# EAGLE design working (EAGLE 9.5.1)
COMPANY: ADAFRUIT INDUSTRIES; DRAWN: KTOWN; REV: A
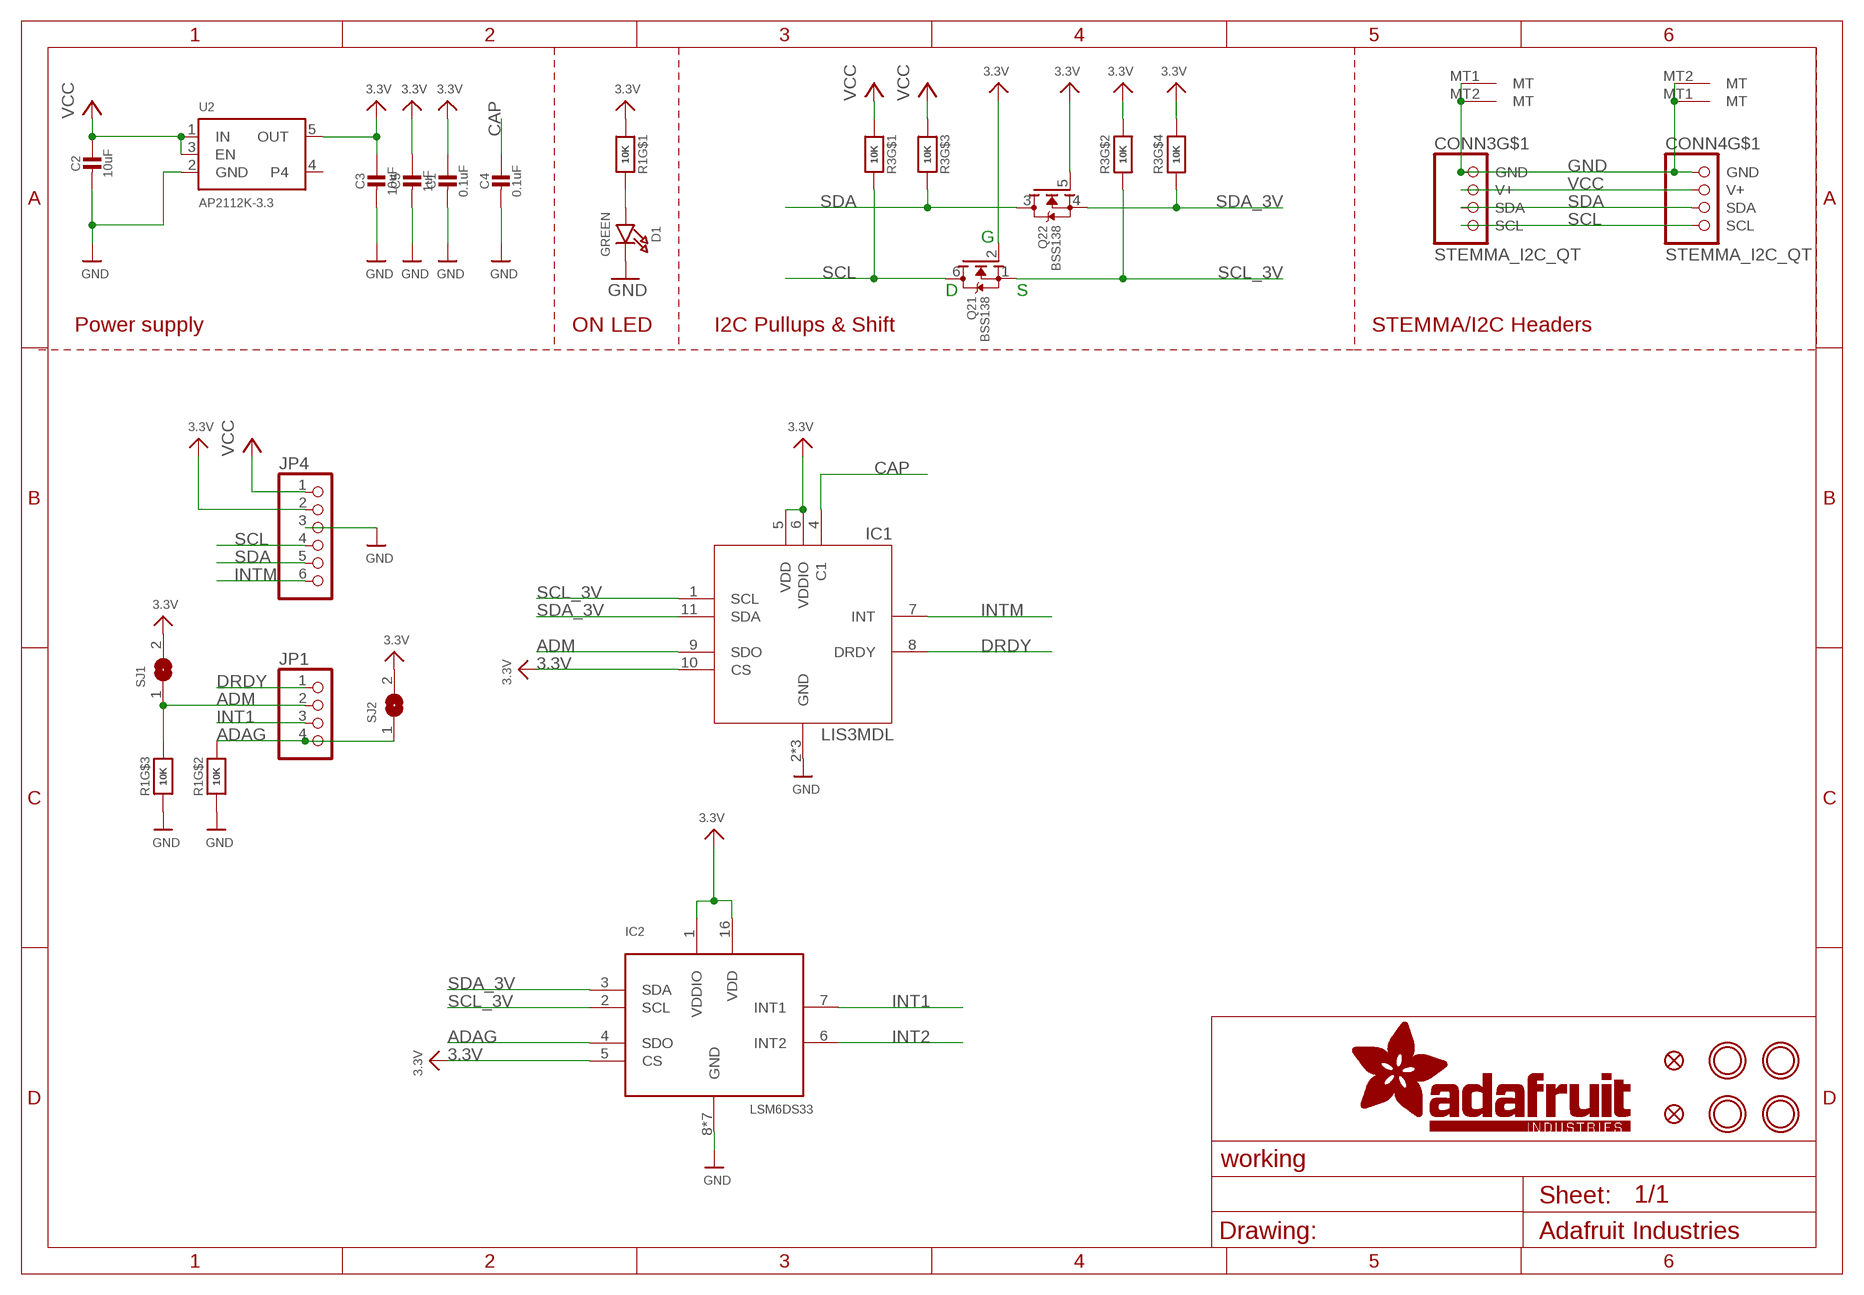
[diagram p0: schematic, sheet 1]

## Parts
C1  0.1uF  CAP_CERAMIC0603_NO  [0603-NO]
C2  10uF  CAP_CERAMIC0805-NOOUTLINE  [0805-NO]
C3  10uF  CAP_CERAMIC0805-NOOUTLINE  [0805-NO]
C4  0.1uF  CAP_CERAMIC0603_NO  [0603-NO]
C5  1uF  CAP_CERAMIC0603_NO  [0603-NO]
CONN3  STEMMA_I2C_QT  [JST_SH4]
CONN4  STEMMA_I2C_QT  [JST_SH4]
D1  GREEN  LED0603_NOOUTLINE  [CHIPLED_0603_NOOUTLINE]
FID3  FIDUCIAL_1MM  [FIDUCIAL_1MM]
FID4  FIDUCIAL_1MM  [FIDUCIAL_1MM]
IC1  LIS3MDL  [LGA12_2X2MM]
IC2  LSM6DS33  [LGA16_3X3MM]
JP1  HEADER-1X4ROUND  [1X04_ROUND]
JP4  HEADER-1X670MIL  [1X06_ROUND_70]
Q2  BSS138  MOSFET-N_DUAL  [SOT363]
R1  10K  RESISTOR_4PACK  [RESPACK_4X0603]
R3  10K  RESISTOR_4PACK  [RESPACK_4X0603]
SJ1  SOLDERJUMPER  [SOLDERJUMPER_ARROW_NOPASTE]
SJ2  SOLDERJUMPER  [SOLDERJUMPER_ARROW_NOPASTE]
U2  AP2112K-3.3  VREG_SOT23-5  [SOT23-5]
U$1  MOUNTINGHOLE2.5  [MOUNTINGHOLE_2.5_PLATED]
U$17  MOUNTINGHOLE2.5  [MOUNTINGHOLE_2.5_PLATED]
U$19  MOUNTINGHOLE2.5  [MOUNTINGHOLE_2.5_PLATED]
U$21  MOUNTINGHOLE2.5  [MOUNTINGHOLE_2.5_PLATED]

## Nets
3.3V [lowpower]: C1.1 C3.1 C5.1 IC1.5(VDD) IC1.6(VDDIO) IC1.10(CS) IC2.1(VDDIO) IC2.5(CS) IC2.16(VDD) JP4.2 Q2.2(1:G) Q2.5(2:G) R1.1 R3.2 R3.4 SJ1.2 SJ2.2 U2.5(OUT)
ADAG: IC2.4(SDO) JP1.4 R1.7 SJ2.1
ADM: IC1.9(SDO) JP1.2 R1.6 SJ1.1
CAP: C4.1 IC1.4(C1)
DRDY: IC1.8(DRDY) JP1.1
GND: C1.2 C2.2 C3.2 C4.2 C5.2 CONN3.1(GND) CONN3.MT1(MT) CONN3.MT2(MT) CONN4.1(GND) CONN4.MT1(MT) CONN4.MT2(MT) D1.C IC1.2(GND) IC1.3(GND) IC1.12(GND) IC2.8(GND) IC2.9(GND) IC2.10(GND) IC2.11(GND) IC2.12(GND) IC2.13(GND) IC2.15(GND) JP4.3 R1.2 R1.3 U2.2(GND)
INT1: IC2.7(INT1) JP1.3
INT2: IC2.6(INT2)
INTM: IC1.7(INT) JP4.6
N$1: D1.A R1.8
SCL: CONN3.4(SCL) CONN4.4(SCL) JP4.4 Q2.6(1:D) R3.8
SCL_3V: IC1.1(SCL) IC2.2(SCL) Q2.1(1:S) R3.7
SDA: CONN3.3(SDA) CONN4.3(SDA) JP4.5 Q2.3(2:D) R3.6
SDA_3V: IC1.11(SDA) IC2.3(SDA) Q2.4(2:S) R3.5
VCC [lowpower]: C2.1 CONN3.2(V+) CONN4.2(V+) JP4.1 R3.1 R3.3 U2.1(IN) U2.3(EN)
Unconnected: R1.4 R1.5 U2.4

## Notes on the sheet
- G
- D | S
- Power supply | ON LED | I2C Pullups & Shift | STEMMA/I2C Headers

## Library data of the parts
C1-C5 = microbuilder:CAP_CERAMIC: Ceramic Capacitors For new designs, use the packages preceded by an '_' character since they are more reliable: The following footprints should be used on most boards: _0402 - Standard footprint for regular board layouts _0603 - Standard footprint for regular board layouts _0805 - Standard footprint for regular board layouts _1206 - Standard footprint for regular board layouts For extremely tight-pitch boards where space is at a premium, the following 'micro-pitch' footprints can be used (smaller pads, no silkscreen outline, etc.): _0402MP - Micro-pitch footprint for very dense/compact boards _0603MP - Micro-pitch footprint for very dense/compact boards _0805MP - Micro-pitch footprint for very dense/compact boards _1206MP - Micro-pitch footprint for very dense/compact boards
CONN3 CONN4 = microbuilder:STEMMA_I2C
D1 = microbuilder:LED: LED 0603 - 0603 Surface Mount Package 2mA: Green LED - Low Power (3.9mcd, 2ma, 1.7Vf) - Digikey: 475-2709-2-ND Orange LED - Low Power (9.8mcd, 2ma, 1.8Vf) - Digikey: 475-1194-2-ND Red LED - Low Power (5mcd, 2ma, 1.8Vf) - Digikey: 475-1195-2-ND Yellow LED - Low Power (7mcd, 2ma, 1.8Vf) - Digikey: 475-1196-2-ND 5mA: Blue LED - Low Power (17mcd, 5ma, 2.9Vf) - Digikey: LNJ937W8CRACT-ND 0805 - 0805 Surface Mount Package 2mA: Red LED (8.8mcd, 2mA, 1.8Vf, Clear) - Low Power [Digikey: 475-2510-1-ND] Green LED (5mcd, 2mA, 1.8Vf, Clear) - Low Power [Digikey: 475-2730-1-ND] Yellow LED (11.3mcd, 2mA, 1.8Vf, Clear) - Low Power [Digikey: 475-2555-1-ND] 20mA: Red LED (104mcd, 20mA, Diffused) - LS R976 [Digikey: 475-1278-6-ND] Red LED (12mcd, 20mA, 2.0Vf, Clear) - APT2012EC [Digikey: 754-1128-1-ND] Green LED (15mcd, 20mA, 2.2Vf, Clear) - APT2012GC [Digikey: 754-1131-1-ND] Orange LED (160mcd, 20mA, 2.1Vf, Clear) - APT2012SECK [Digikey: 754-1130-1-ND] 1206 - 1206 Surface Mount Package Green LED (26mcd, 20mA, Diffused) - LG N971 [Digikey: 475-1407-6-ND] Red LED (15mcd, 20mA, Diffused) - LH N974 [Digikey: 475-1416-6-ND] Cree - Cree High-Power Surface Mount LEDs XPEBWT-L1-0000-00D50 - White 111lm 350mA 2.9Vf 6200K 110° XTEAWT-00-0000-00000LEE3 - White 114lm 350mA 2.85Vf 5000K 115° Everlight - Everlight 45-21 Series Surface Mount LEDs 45-21/QK2C-B2832AC2CB2/2T - Warm White 2000mcd 20mA 3.25Vf 3050K 120° 45-21/LK2C-B38452C4CB2/2T - Nuetral White 2000mcd 20mA 3.25Vf 4150K 120° 45-21/LK2C-B50634C6CB2/2T - Cold White 2200mcd 20mA 3.25Vf 5650K 120° PLCC2 Reverse Mount LS T77K-J1L2-1-0-2-R18-Z - Red 11.25mcd 2mA 1.8Vf 630nm 120° LO T77K-L1M2-24-Z - Orange 19.6mcd 2mA 1.8Vf 606nm 120° LY T77K-K2M1-26-Z - Yellow 15.7mcd 2mA 1.8Vf 587nm 120°
FID3 FID4 = microbuilder:FIDUCIAL: Fiducial Alignment Points Various fiducial points for machine vision alignment.; BOM: EXCLUDE
IC1 = adafruit_sensor:LIS3MDL: Digital output magnetic sensor. ultra-low-power, high-performance 3-axis magnetometer
IC2 = adafruit_sensor:LSM6DS33
JP1 = microbuilder:HEADER-1X4: PIN HEADER
JP4 = microbuilder:HEADER-1X6: PIN HEADER
Q2 = microbuilder:MOSFET-N_DUAL: Dual N-Channel MOSFET SOT363 (2.0x1.25mm) 2N7002PS - 60V, 320mA [Digikey: 568-5984-1-ND]
R1 R3 = microbuilder:RESISTOR_4PACK: Resistor Packs (4 resistors) 4 x 0603 10K 1/16W - Digikey: YC164J-10KCT-ND
SJ1 SJ2 = microbuilder:SOLDERJUMPER: SMD Solder JUMPER Solder the two pads together to create a connection, or remove the solder to break it. REFLOW - Use this footprint for solder paste and reflow ovens. WAVE - Use this footprint for hand-soldering (larger pads). CLOSED - Has a trace between the two pads to ensure it is closed by default. The trace needs to be cut to disable the jumper, and can be closed again by creating a solder bridge between the two pads.; BOM: EXCLUDE
U2 = microbuilder:VREG_SOT23-5: SOT23-5 Fixed Voltage Regulators Part Current Out V Out V In V Dropout θJA (°C/W) TJ (°C) Digikey Part No. ADP121 150mA 3.3V 3.4-5.5V 0.09V @ 150mA -- -- ADP121-AUJZ33R7CT-ND ADP121 150mA 3.0V 3.1-5.5V 0.09V @ 150mA -- -- ADP121-AUJZ30R7CT-ND ADP122 300mA 3.3V 3.4-5.5V 0.085V @ 300mA -- -- ADP122AUJZ-3.3-R7CT-ND ADP1712 300mA 3.3V 3.5-5.5V 0.17V @ 300mA -- -- ADP1712AUJZ-3.3-R7TR-ND AP7311 (Low Cost) 150mA 3.3V 3.5-6V 0.15V @ 150mA -- -- AP7311-33WG-7DICT-ND LD39015M18R 150mA 1.8V 1.9V-5.5V 0.08V @ 100mA -- -- 497-6977-1-ND LP2985A-33DBVR 150mA 3.3V 3.3-16V 0.28V @ 150mA 206 150 296-18479-1-ND MCP1824T-3302E/OT 300mA 3.3V 3.5V-6V 0.2V @ 300mA -- -- MCP1824T-3302E/OTCT-ND MIC5205-2.5YM5 TR 150mA 2.5V 2.7-16V 0.165V @ 150mA -- -- 576-1257-2-ND MIC5205-3.0YM5 TR 150mA 3.0V 3.2V-16V 0.165V @ 150mA -- -- 576-1258-2-ND MIC5205-3.3YM5 TR 150mA 3.3V 3.5V-16V 0.165V @ 150mA -- -- 576-1259-2-ND TPS780330220 150mA 3.3V+2.2V 3.6-5.5V 250mV Max -- -- 296-23332-1-ND TDA3663/N1,135 100mA 3.3V 3.5-45V 0.18V @ 50mA -- -- 568-5343-1-ND Max operating temp can be calculated using θJA, TJ (max junction temperature), and power in watts. Set the "Maximum Ambient Temperature" until it reaches TJ ("Max Junction Temperature"), which is the absolute limit for safe use of the regulator: Heat Sink Temperature Calculator <http://www.daycounter.com/Calculators/Heat-Sink-Temperature-Calculator.phtml> For example, With 12V source into a 3.3V LP2985 and a 30mA load, we are dissipating (12V-3.3V) * 0.03A = 0.261W. With a θJA of 206 °C/W, a TJ of 150°C, and 261mW we can safely use the chip without a heat sink up to 75°C (=147.1°C Junction Temperature).
U$1 U$17 U$19 U$21 = microbuilder:MOUNTINGHOLE: Mounting Hole For #2 screws (0.086"/2.18mm width, 0.094"/2.4mm hole) use 2.5mm; BOM: EXCLUDE

## Net classes
1 highpower: width 0.406 mm, drill 0.483 mm
2 lowpower: width 0.305 mm, drill 0.483 mm

## Board
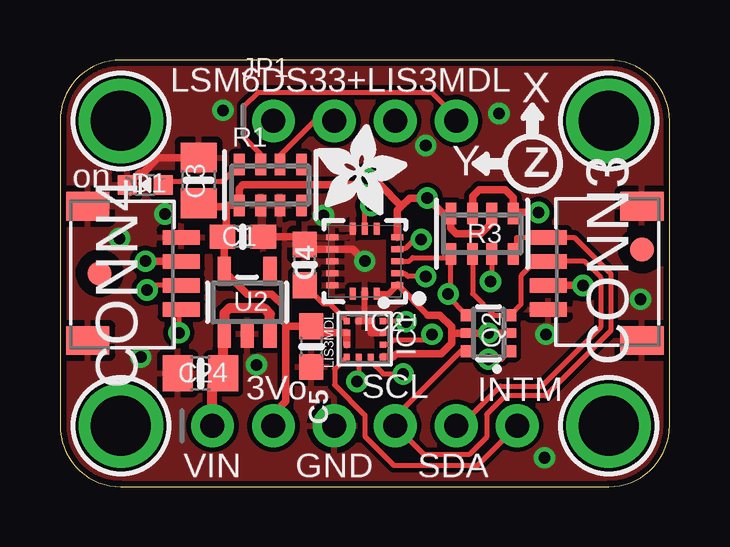
[diagram p1: board, top side]
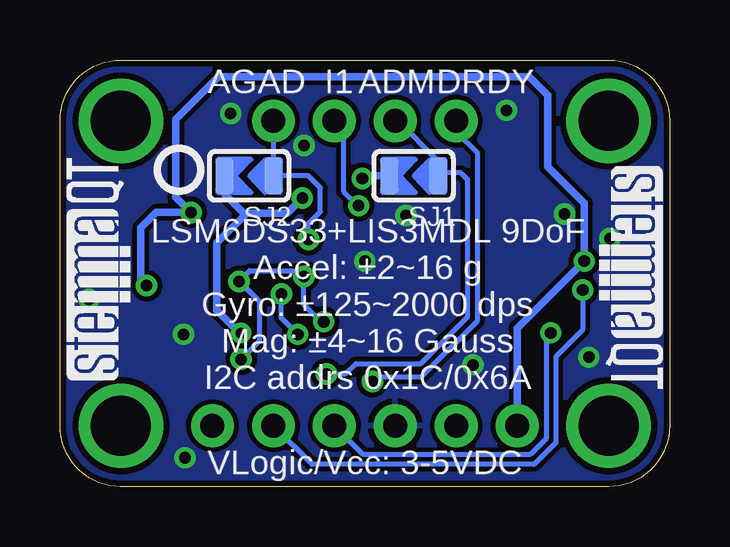
[diagram p2: board, bottom side, seen from below]

Size 25.4 x 17.78 mm. Coordinates in mm from the lower left corner, seen from the top.
Outline: 0,15.24 0,2.54 arc90 2.54,0 22.86,0 arc90 25.4,2.54 25.4,15.24 arc90 22.86,17.78 2.54,17.78 arc90 0,15.24
Copper layers (1*16): Top 0.035mm / dielectric 1.5mm / Bottom 0.035mm
Design rules "adafruit *": minimum track width 8mil, minimum drill 15.5mil, track to track 8mil, track to pad 8mil, pad to pad 8mil, via to via 8mil, smd to smd 8mil, copper to edge 10mil, drill to drill 8mil, minimum pad ring 10mil, minimum via ring 8mil, stop-mask expansion 2mil, vias tented up to drill 20mil, thermal gap 10mil

### Footprints (pad centres in the part's own frame; a part is rotated, then mirrored left to right if it is on the bottom)
0603-NO = smd 1.075 x 1: 1 -0.85,0; 2 0.85,0
0805-NO = smd 1.24 x 1.5: 1 -0.95,0; 2 0.95,0
JST_SH4 = smd 0.6 x 1.55: 1 -1.5,2.514; 2 -0.5,2.514; 3 0.5,2.514; 4 1.5,2.514 | smd 1.2 x 1.8: MT1 -2.8,-1.386; MT2 2.8,-1.386
CHIPLED_0603_NOOUTLINE = smd 0.8 x 0.8: A 0,-0.75; C 0,0.75
FIDUCIAL_1MM = smd 1 x 1: 1 0,0
LGA12_2X2MM = smd 0.275 x 0.25: 1 -0.75,0.75; 2 -0.75,0.25; 3 -0.75,-0.25; 4 -0.75,-0.75; 7 0.75,-0.75; 8 0.75,-0.25; 9 0.75,0.25; 10 0.75,0.75 | smd 0.25 x 0.275: 5 -0.25,-0.75; 6 0.25,-0.75; 11 0.25,0.75; 12 -0.25,0.75
LGA16_3X3MM = smd 0.5 x 0.25: 1 -1.35,1; 2 -1.35,0.5; 3 -1.35,0; 4 -1.35,-0.5; 5 -1.35,-1; 9 1.35,-1; 10 1.35,-0.5; 11 1.35,0; 12 1.35,0.5; 13 1.35,1 | smd 0.25 x 0.5: 6 -0.5,-1.35; 7 0,-1.35; 8 0.5,-1.35; 14 0.5,1.35; 15 0,1.35; 16 -0.5,1.35
1X04_ROUND = drill 1 pad 1.778: 1 -3.81,0; 2 -1.27,0; 3 1.27,0; 4 3.81,0
1X06_ROUND_70 = drill 1 pad 1.778: 1 -6.35,0; 2 -3.81,0; 3 -1.27,0; 4 1.27,0; 5 3.81,0; 6 6.35,0
SOT363 = smd 0.5 x 0.5: 1 -0.75,-0.9; 3 0.75,-0.9; 4 0.75,0.9; 6 -0.75,0.9 | smd 0.4 x 0.5: 2 0,-0.9; 5 0,0.9
RESPACK_4X0603 = smd 0.45 x 0.9: 1 -1.3,-0.85; 2 -0.4,-0.85; 3 0.4,-0.85; 4 1.3,-0.85; 5 1.3,0.85; 6 0.4,0.85; 7 -0.4,0.85; 8 -1.3,0.85
SOLDERJUMPER_ARROW_NOPASTE = smd 0.762 x 1.524: 1 -1.016,0; 2 1.016,0
SOT23-5 = smd 0.55 x 1.2: 1 -0.95,-1.3; 2 0,-1.3; 3 0.95,-1.3; 4 0.95,1.3; 5 -0.95,1.3
MOUNTINGHOLE_2.5_PLATED = drill 2.5 pad 3.2: P$1 0,0

### Placement (x,y rotation side)
C1  7.62,10.41 0 top
C2  5.85,4.72 180 top
C3  5.78,12.76 90 top
C4  10.2,9.25 90 top
C5  10.48,5.84 270 top
CONN3  22.86,8.89 90 top
CONN4  2.54,8.89 270 top
D1  3.56,12.57 90 top
FID3  1.65,8.89 0 top
FID4  24.26,9.88 0 top
IC1  12.7,6.16 270 top
IC2  12.7,9.4 180 top
JP1  12.7,15.24 0 top
JP4  12.7,2.54 0 top
Q2  17.86,6.4 90 top
R1  8.76,12.57 0 top
R3  17.59,10.54 180 top
SJ1  10.67,12.95 180 bottom
SJ2  17.53,12.95 180 bottom
U2  7.8,7.68 0 top
U$1  2.54,15.24 0 top
U$17  22.86,15.24 0 top
U$19  2.54,2.54 0 top
U$20  [ADAFRUIT_3.5MM]  10.67,11.3 0 top
U$21  22.86,2.54 0 top
U$25  [PCBFEAT-REV-040]  20.45,13.21 0 bottom
U$30  [STEMMAQT]  22.48,4.45 90 bottom
U$31  [STEMMAQT]  2.92,13.34 270 bottom

### Tracks (layer width: path | path; a pad name or v marks a point on that pad's centre or on a via)
3.3V  (via drill 0.45, 0.48)
  Top 0.254: IC2.16 13.7,8.05 IC2.1 | 14.07,8.41 15.33,7.15
  Top 0.305: JP4.2 8.89,3.05 9.4,3.56 9.4,6.79 | IC2.1 14.07,8.41 | Q2.2 v17.86,6.4 Q2.5 16.32,6.4 | IC2.5 14.05,11.51 14.22,11.68 | 14.22,11.68 14.57,12.03 v15.3,12.03 15.94,11.39 R3.4 16.29,10.76 16.51,10.54 17.53,10.54 17.99,11.01 R3.2 | 6.92,11.66 5.62,11.66 C3.1 | 9.4,6.79 9.4,7.46 8.83,8.03 7.8,8.03 U2.5 6.85,10.34 C1.1 6.92,10.57 6.92,11.66 | 6.92,11.66 6.92,11.72 R1.1 7.46,12.42 7.62,12.57 13.08,12.57 | IC1.6 IC1.5 10.76,6.41 C5.1 9.5,6.69 9.4,6.79 | IC1.10 13.89,5.41 14.02,5.54 15.89,5.54 16.32,5.97 16.32,6.4 | 13.08,12.57 13.34,12.57 14.22,11.68 | 15.33,7.15 15.82,7.15 16.32,6.66 16.32,6.4 | v12.8,12.85 13.08,12.57
  Bottom 0.305: v15.3,12.03 15.94,11.39 17.63,11.39 17.68,11.34 | 17.68,11.34 18.86,10.16 18.86,7.35 17.91,6.4 v17.86,6.4 | SJ2.2 18.54,12.19 17.68,11.34 | SJ1.2 12.7,12.95 v12.8,12.85
ADAG  (via drill 0.48)
  Top 0.203: IC2.4 14.09,9.94 14.4,9.94 14.76,10.3 v15.05,10.3 | R1.7 8.36,13.86 7.68,14.54 7.68,15.88 8.26,16.45 15.49,16.45 16.51,15.43 JP1.4
  Bottom 0.203: v15.05,10.3 15.05,10.97 14.55,11.46 14.55,12.46 15.05,12.95 SJ2.1 | JP1.4 SJ2.1 | 17.14,12.95 SJ2.1
ADM  (via drill 0.48)
  Top 0.203: IC1.9 12.95,5.22 13.47,4.7 v14.3,4.7 | R1.6 9.16,13.8 10.6,15.24 JP1.2
  Bottom 0.203: v14.3,4.7 13.51,4.7 13.07,5.13 10.37,5.13 8.41,7.08 8.41,12.8 8.7,13.08 9.65,13.08 | SJ1.1 9.65,13.08 | 9.65,13.08 9.65,13.59 11.3,15.24 JP1.2
CAP
  Top 0.203: C4.1 10.97,7.62 11.24,7.62 IC1.4
DRDY  (via drill 0.48)
  Top 0.203: IC1.8 12.45,4.45 v12.38,4.38
  Bottom 0.203: v12.38,4.38 12.19,4.57 10.35,4.57 8,6.92 8,13.91 8.89,14.8 JP1.1
GND  (via drill 0.48)
  Top 0.254: 12.7,6.91 IC2.15
  Top 0.305: v12.7,9.4 12.2,9.9 IC2.10 10.4,9.9 C4.2 9.88,10.41 C1.2 | IC1.3 12.7,6.91 | IC1.12 12.97,6.42 12.97,6.91 IC1.2 | D1.C 3.31,13.07 3.44,13.07 4.08,13.71 C3.2
  other vias: 20.26,6.35 24.19,7.81 15.24,14.22 4.38,11.37 8.19,5.08 20.19,1.21 10.99,11.3 6.79,15.68 3.37,5.4 18.29,15.56 2.48,10.35
  pour Top: 0,17.78 25.4,17.78 25.4,0 0,0
  pour Bottom: 0,17.78 25.4,17.78 25.4,0 0,0
INT1  (via drill 0.48)
  Top 0.203: IC2.7 12.7,11.46 v12.95,11.71
  Bottom 0.203: JP1.3 13.59,14.86 13.59,12.32 12.98,11.71 v12.95,11.71
INTM
  Top 0.203: IC1.7 11.44,4.9 11.44,4.24 12.7,2.98 12.7,2.1 13.91,0.89 17.4,0.89 JP4.6
N$1
  Top 0.203: D1.A 4.47,12.74 6.78,12.74 R1.8
SCL  (via drill 0.48)
  Top 0.203: R3.8 19.01,9.69 19.01,10.39 CONN3.4 21.43,10.39 22.95,8.87 22.95,6.5 20.23,3.79 18.55,3.79 17.78,3.01 17.78,2.07 17.05,1.33 15.18,1.33 JP4.4 13.97,2.92 16.7,5.65 Q2.6 | CONN4.4 4.95,7.29 v4.95,6.41
  Bottom 0.203: v4.95,6.41 5.14,6.22 5.14,2 5.81,1.33 12.76,1.33 JP4.4
SCL_3V  (via drill 0.48)
  Top 0.203: R3.7 17.99,8.61 v17.94,8.56 | IC1.1 14.37,6.91 v14.41,6.87 | Q2.1 18.41,5.31 v17.85,5.31 | v15.24,8.76 14.49,8.76 14.38,8.87 14.08,8.87 IC2.2
  Bottom 0.203: v14.41,6.87 14.54,6.87 15.24,7.58 v15.24,8.76 15.48,9 17.49,9 v17.94,8.56 17.08,7.7 17.08,6.08 v17.85,5.31
SDA  (via drill 0.48)
  Top 0.203: R3.6 17.19,8.04 18.08,7.15 Q2.3 19.2,7.59 19.2,8.79 19.8,9.39 CONN3.3 21.85,9.39 22.54,8.7 22.54,6.67 20.07,4.19 18.35,4.19 16.7,2.54 JP4.5 | CONN4.3 3.82,8.39 v3.62,8.19
  Bottom 0.203: v3.62,8.19 3.62,6.54 4.74,5.42 4.74,1.83 5.64,0.93 14.9,0.93 JP4.5
SDA_3V  (via drill 0.48)
  Top 0.203: v15.49,6.35 15.24,6.1 13.89,6.1 13.7,5.91 IC1.11 | Q2.4 16.18,7.93 v16.18,8.03 16.29,8.14 16.29,9.59 | 16.29,9.59 R3.5 | IC2.3 14.54,9.4 14.69,9.55 16.25,9.55 16.29,9.59
  Bottom 0.203: v15.49,6.35 16.18,7.03 v16.18,8.03
VCC  (via drill 0.48)
  Top 0.305: v19.94,11.43 18.93,11.43 R3.1 18.89,12.04 18.54,12.38 17.46,12.38 17.19,12.11 R3.3 | CONN3.2 v21.79,8.39 v21.79,8.38 | CONN4.2 v3.56,9.39 v3.56,9.4
  Top 0.406: JP4.1 6.35,4.27 C2.1 6.8,6.34 U2.1 6.85,7.23 7.05,7.43 8.51,7.43 8.75,7.19 U2.3
  Bottom 0.305: v21.79,8.38 22.04,8.38 22.04,10.79 21.4,11.43 v19.94,11.43 20.57,12.06 20.57,15.3 18.8,17.08 5.84,17.08 5.08,16.32 5.08,13.34 3.56,11.81 v3.56,9.4 6.35,6.6 JP4.1

### Text on the board
tPlace: LSM6DS33+LIS3MDL | X | Y | Z | on | 3Vo | SCL | INTM | VIN | GND | SDA
bPlace: DRDY | ADM | I1 | AGAD | LSM6DS33+LIS3MDL 9DoF / Accel: ±2~16 g / Gyro: ±125~2000 dps / Mag: ±4~16 Gauss / I2C addrs 0x1C/0x6A | VLogic/Vcc: 3-5VDC